# EAGLE design USB To Uart_3V3 (EAGLE 6.4)
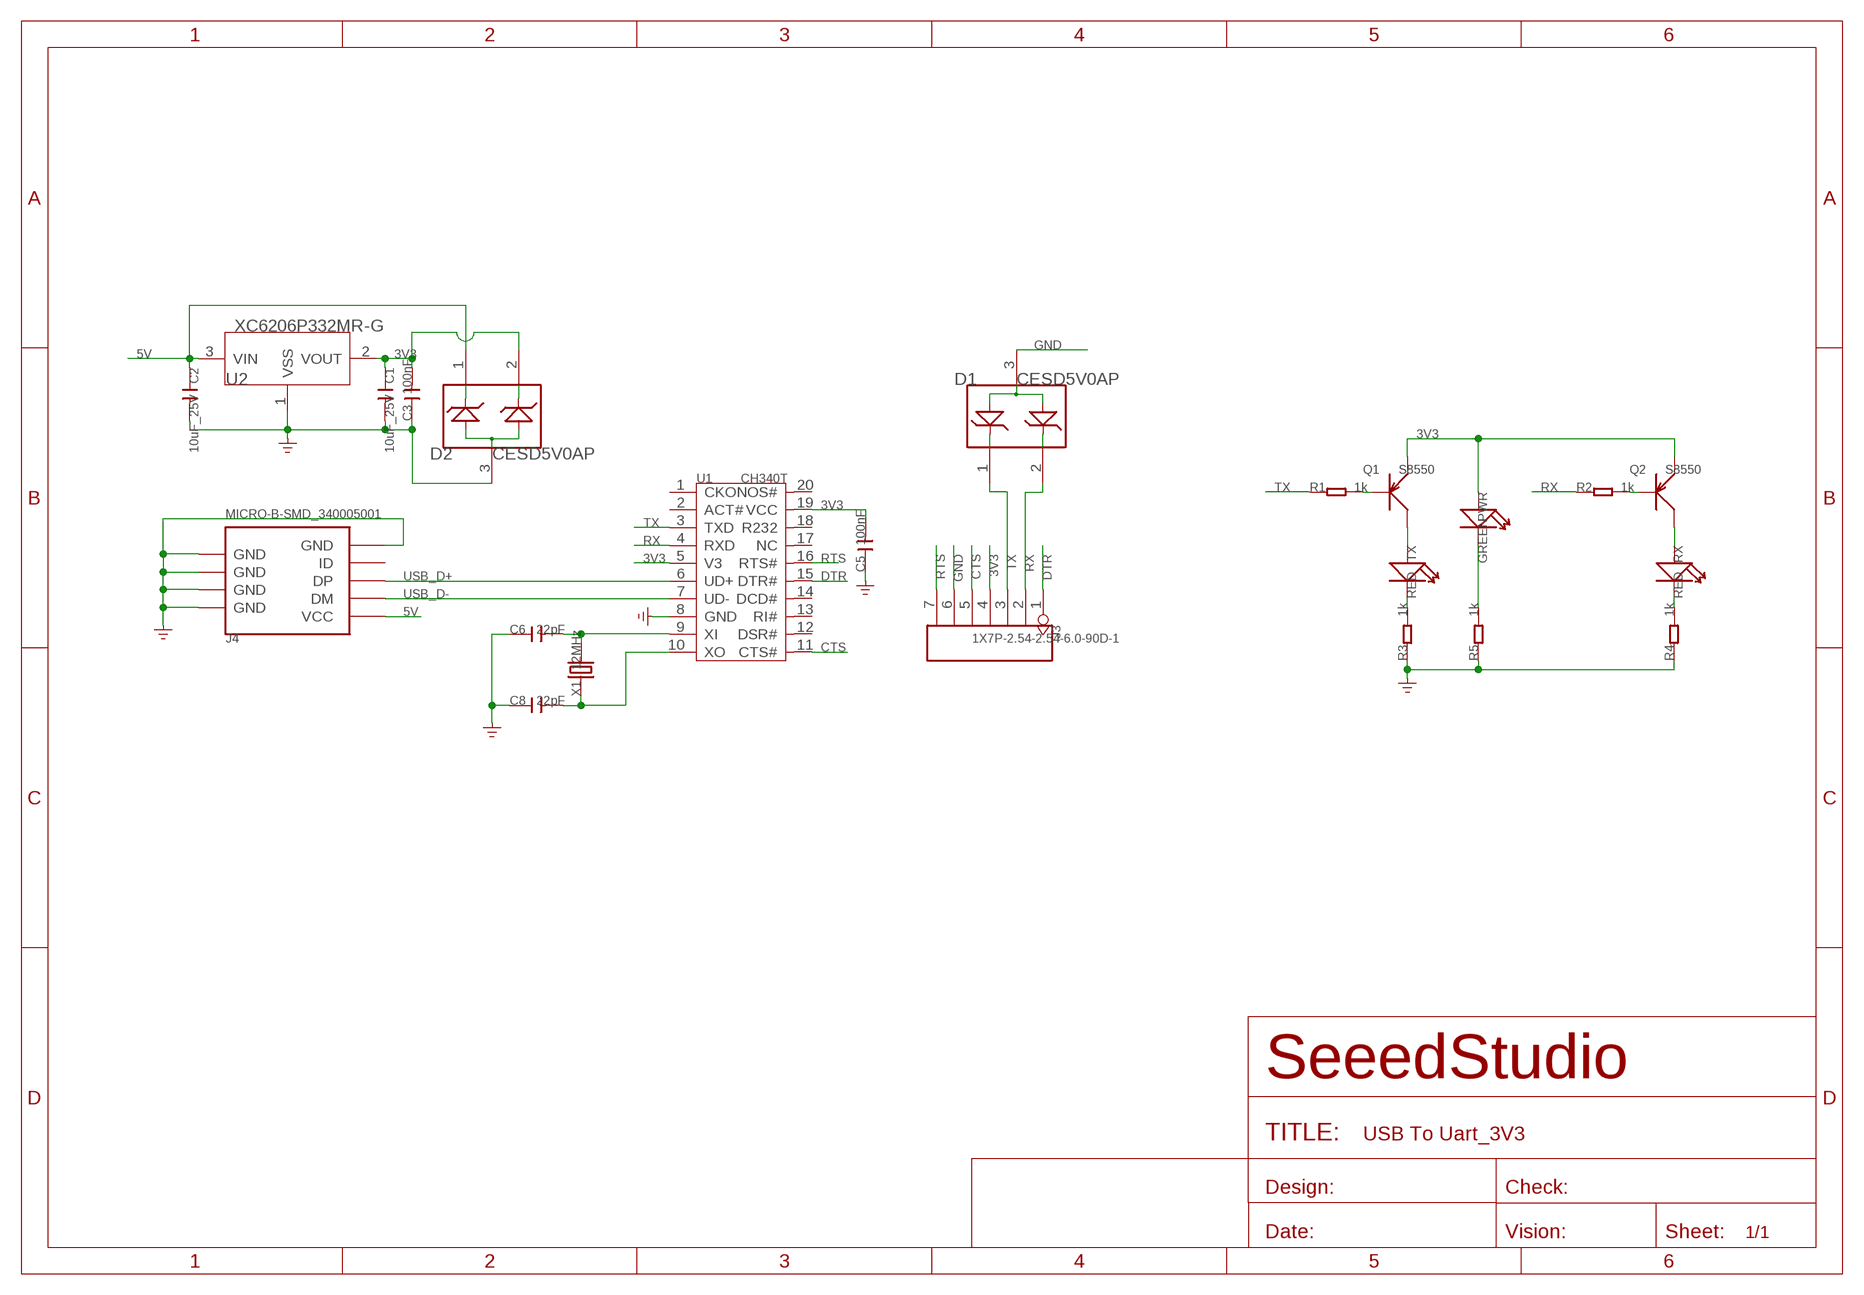
[diagram p0: schematic, sheet 1]

## Parts
C1  10uF_25V  C-0805  [C0805]
C2  10uF_25V  C-0805  [C0805]
C3  100nF  C-0402  [C0402]
C5  100nF  C-0402  [C0402]
C6  22pF  C-0402  [C0402]
C8  22pF  C-0402  [C0402]
D1  CESD5V0AP  D-ESD-3P  [SOT23]
D2  CESD5V0AP  D-ESD-3P  [SOT23]
J3  1X7P-2.54-2.54-6.0-90D-1  HEADER-7P  [7P-2.54-65/35MIL]
J4  MICRO-B-SMD_340005001  USB-MINIUSB-5P-MICRO  [MICRO-USB]
PWR  GREEN  LED'0603'  [LED-0603]
Q1  S8550  TRANSISTOR-PNP-SOT23  [SOT23]
Q2  S8550  TRANSISTOR-PNP-SOT23  [SOT23]
R1  1k  R-0402  [R0402]
R2  1k  R-0402  [R0402]
R3  1k  R-0402  [R0402]
R4  1k  R-0402  [R0402]
R5  1k  R-0402  [R0402]
RX  RED  LED'0603'  [LED-0603]
TX  RED  LED'0603'  [LED-0603]
U1  CH340T  [SSOP20]
U2  XC6206P332MR-G  XC6206MR  [SOT23]
X1  12MHz  CRYSTAL'HC49UP'  [HC49UP]

## Nets
3V3: C1.1 C3.2 C5.2 D2.2 J3.4 PWR.+ Q1.2(E) Q2.2(E) U1.5(V3) U1.19(VCC) U2.2(VOUT)
5V: C2.1 D2.1 J4.1(VCC) U2.3(VIN)
CTS: J3.5 U1.11(CTS#)
DTR: J3.1 U1.15(DTR#)
GND: C1.2 C2.2 C3.1 C5.1 C6.1 C8.1 D1.3 D2.3 J3.6 J4.5(GND) J4.S1(GND) J4.S2(GND) J4.S3(GND) J4.S4(GND) J4.S5(GND) J4.S6(GND) R3.1 R4.1 R5.1 U1.8(GND) U2.1(VSS)
N$1: Q1.3(C) TX.+
N$2: Q2.3(C) RX.+
N$4: C6.2 U1.9(XI) X1.2
N$5: C8.2 U1.10(XO) X1.1
N$6: R3.2 TX.-
N$7: Q1.1(B) R1.2
N$8: Q2.1(B) R2.2
N$10: R4.2 RX.-
N$12: PWR.- R5.2
RTS: J3.7 U1.16(RTS#)
RX: D1.2 J3.2 R2.1 U1.4(RXD)
TX: D1.1 J3.3 R1.1 U1.3(TXD)
USB_D+: J4.3(DP) U1.6(UD+)
USB_D-: J4.2(DM) U1.7(UD-)
Unconnected: J4.4(ID) U1.1(CKO) U1.2(ACT#) U1.12(DSR#) U1.13(RI#) U1.14(DCD#) U1.17(NC) U1.18(R232) U1.20(NOS#)

## Library data of the parts
C1-C3 C5 C6 C8 = Discrete:C*: Ceramic Capacitors
D1 D2 = Discrete:D-ESD-3P
J3 = Connector :HEADER-7P
J4 = Connector :USB-MINIUSB-5P
PWR RX TX = Discrete:LED*
Q1 Q2 = Discrete:TRANSISTOR-PNP*: PNP audion
R1-R5 = Discrete:R*
U1 = template:CH340T
U2 = IC:XC6206: LOW ESR Cap.Compatible Positive Voltage Regulators
X1 = Discrete:CRYSTAL*: CRYSTAL

## Net classes
0 default: width 0.152 mm, drill 0.305 mm, clearance 0.152 mm

## Board
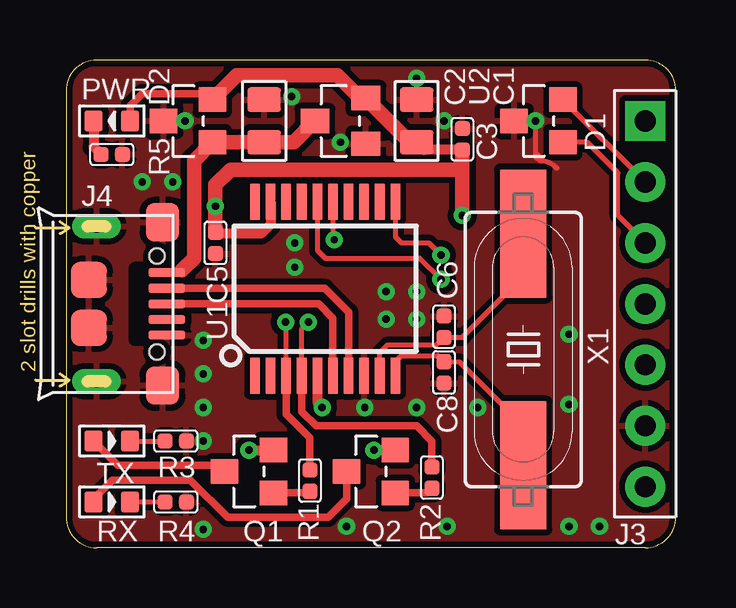
[diagram p1: board, top side]
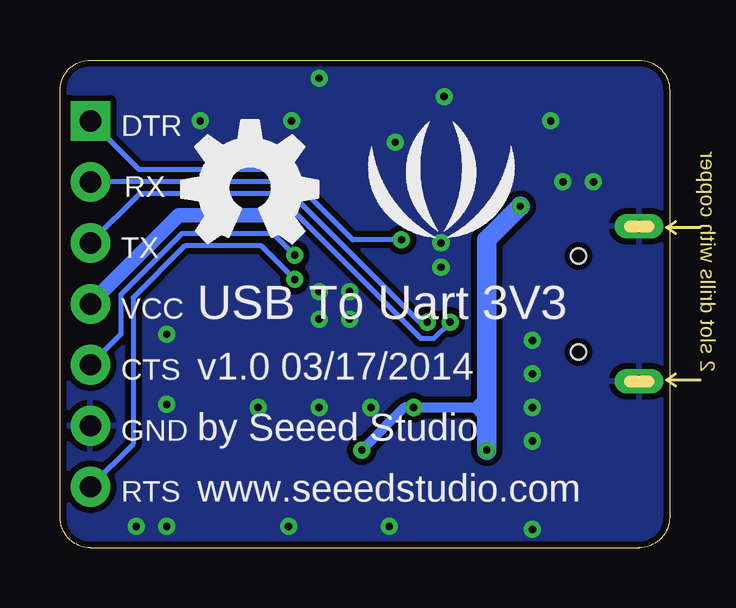
[diagram p2: board, bottom side, seen from below]

Size 25.4 x 20.32 mm. Coordinates in mm from the lower left corner, seen from the top.
Outline: 0,19.05 0,1.27 arc90 1.27,0 24.13,0 arc90 25.4,1.27 25.4,19.05 arc90 24.13,20.32 1.27,20.32 arc90 0,19.05
Copper layers (1*16): Top 0.035mm / dielectric 1.5mm / Bottom 0.035mm
Design rules "default *": minimum track width 8mil, minimum drill 12mil, track to track 8mil, track to pad 8mil, pad to pad 8mil, via to via 8mil, smd to smd 0mil, copper to edge 8mil, drill to drill 8mil, minimum pad ring 10mil, minimum via ring 8mil, stop-mask expansion 4mil, vias tented up to drill 25mil, thermal gap 10mil

### Footprints (pad centres in the part's own frame; a part is rotated, then mirrored left to right if it is on the bottom)
C0805 = smd 1.016 x 1.397: 1 -0.889,0; 2 0.889,0
C0402 = smd 0.635 x 0.635: 1 -0.445,0; 2 0.445,0
SOT23 = smd 1.016 x 1.143: 1 -0.889,-1.016; 2 0.889,-1.016; 3 0,1.016
7P-2.54-65/35MIL = drill 0.889 pad 1.651 square: 1 0,7.62 | drill 0.889 pad 1.651: 2 0,5.08; 3 0,2.54; 4 0,0; 5 0,-2.54; 6 0,-5.08; 7 0,-7.62
MICRO-USB = smd 0.381 x 1.524: 1 -1.3,-0.25; 2 -0.65,-0.25; 3 0,-0.25; 4 0.65,-0.25; 5 1.3,-0.25 | smd 1.6 x 1.397: S1 -3.4,-0.427; S6 3.4,-0.427 | drill 0.508 pad 1.016 long: S2 -3.226,-3.175; S5 3.226,-3.175 | smd 1.5 x 1.5: S3 -1,-3.5; S4 1,-3.5 | hole 0.635: -2,-0.65; 2,-0.65
LED-0603 = smd 0.762 x 0.889: + -0.762,0; - 0.762,0
R0402 = smd 0.635 x 0.635: 1 -0.445,0; 2 0.445,0
SSOP20 = smd 0.4 x 1.5: 1 -2.925,-3.625; 2 -2.275,-3.625; 3 -1.625,-3.625; 4 -0.975,-3.625; 5 -0.325,-3.625; 6 0.325,-3.625; 7 0.975,-3.625; 8 1.625,-3.625; 9 2.275,-3.625; 10 2.925,-3.625; 11 2.925,3.625; 12 2.275,3.625; 13 1.625,3.625; 14 0.975,3.625; 15 0.325,3.625; 16 -0.325,3.625; 17 -0.975,3.625; 18 -1.625,3.625; 19 -2.275,3.625; 20 -2.925,3.625
SOT23' = smd 1.016 x 1.2: 1 -0.95,-1.06; 2 0.95,-1.06; 3 0,1.06
HC49UP = smd 5.334 x 1.93: 1 -4.826,0; 2 4.826,0

### Placement (x,y rotation side)
C1  14.61,17.78 90 top
C2  8.26,17.78 90 top
C3  16.51,17.02 270 top
C5  6.22,12.7 90 top
C6  15.75,9.21 270 top
C8  15.75,7.3 90 top
D1  19.68,17.78 90 top
D2  5.08,17.78 90 top
J3  24.13,10.16 0 top
J4  4.45,10.16 270 top
PWR  1.91,17.78 180 top
Q1  7.62,3.17 90 top
Q2  12.7,3.17 90 top
R1  10.16,2.79 270 top
R2  15.24,2.92 270 top
R3  4.57,4.45 180 top
R4  4.57,1.91 180 top
R5  1.91,16.38 180 top
RX  1.91,1.91 0 top
TX  1.91,4.45 0 top
U1  10.79,10.79 0 top
U2  XC6206P332MR-G  [SOT23']  11.43,17.78 90 top
U$8  [LOGO_SILK]  9.53,14.61 0 bottom
U$9  [OSHW_FILLX200_NOTEXT]  20.32,12.7 0 bottom
X1  19.05,8.26 90 top

### Tracks (layer width: path | path; a pad name or v marks a point on that pad's centre or on a via)
3V3  (via drill 0.3, 0.3 pad 0.64)
  Top 0.305: D2.2 5.84,18.92 3.17,18.92 2.67,18.41 PWR.+
  Top 0.406: Q2.2 v12.83,4.06 | v7.62,4.06 Q1.2 | U1.5 10.47,6.04 v10.67,5.84 | U1.19 8.52,13.47 8.13,13.08 6.29,13.08 C5.2 | C3.2 14.92,16.57 C1.1
  Top 0.61: C1.1 14.33,16.89 U2.2 12.26,18.73 11.3,19.68 7.11,19.68 D2.2 | C3.2 16.51,16 | 16.51,16 16.26,15.75 6.86,15.75 6.22,15.11 v6.22,14.22 C5.2 | 16.51,16 v16.51,13.84
  Bottom 0.406: 8.13,5.84 v10.67,5.84 11.05,5.84 v12.83,4.06 | 8.13,5.84 7.62,6.35 | 8.13,5.84 7.75,5.46
  Bottom 0.61: v16.51,13.84 20.45,13.84 J3.4
  Bottom 0.813: v7.62,4.06 7.62,6.35 7.62,12.83 v6.22,14.22
5V
  Top 0.203: J4.1 4.73,11.46 4.83,11.56
  Top 0.61: 4.83,11.56 5.33,12.06 5.33,16.13 D2.1 C2.1 9.48,16.89 U2.3
CTS  (via drill 0.3)
  Top 0.203: U1.11 13.72,12.95 13.97,12.7 15.11,12.7 v15.62,12.19
  Bottom 0.203: v15.62,12.19 16.51,13.08 20.32,13.08 22.86,10.54 22.86,8.89 J3.5
DTR  (via drill 0.3)
  Top 0.203: U1.15 11.12,12.88 v11.18,12.83
  Bottom 0.203: v11.18,12.83 13.21,12.83 16.13,15.75 21.84,15.75 22.1,15.75 J3.1
GND  (via drill 0.3 pad 0.64)
  Top 0.203: v19.56,17.78 19.56,16.45 | 19.56,16.45 19.88,16.13 | 19.56,16.45 19.56,16.38 | 19.56,16.38 19.81,16.13 | 20.35,15.9 20.38,15.88 | 19.56,16.38 19.56,16.32 19.75,16.13 arc-45 20.4,15.86 20.45,15.81
  other vias: 5.71,4.45 5.71,0.76 15.88,0.89 11.68,0.89 22.23,0.89 9.53,12.7 5.71,7.24 5.71,5.84 4.45,15.24 9.4,18.8 14.61,19.56 15.75,17.78 3.17,15.24 20.95,0.89 11.43,16.89 13.34,10.67 14.61,10.67 9.53,11.68 13.34,9.53 14.61,9.53 4.95,17.78 12.45,5.84 14.61,5.84 5.71,8.64 17.14,5.84 20.95,5.97 20.95,8.89
  pour Top (isolate 0.254): 0,20.32 25.4,20.32 25.4,0 0,0
  pour Bottom (isolate 0.254): 0,20.32 25.4,20.32 25.4,0 0,0
N$1
  Top 0.305: TX.+ 2.16,3.43 6.35,3.43 Q1.3
N$2
  Top 0.305: RX.+ 1.14,2.03 1.93,2.82 5.18,2.82 6.73,1.27 10.92,1.27 11.68,2.03 Q2.3
N$4
  Top 0.203: U1.9 13.07,8.12 13.4,8.45 15.43,8.45 C6.2 16.51,8.76 18.92,11.18 18.92,12.95 X1.2
N$5
  Top 0.203: U1.10 13.72,7.75 13.97,8 15.49,8 C8.2 16.38,7.75 19.05,5.08 X1.1
N$6
  Top 0.203: TX.- R3.2
N$7
  Top 0.305: Q1.1 10.1,2.29 R1.2
N$8
  Top 0.305: Q2.1 15.05,2.29 R2.2
N$10
  Top 0.203: RX.- R4.2
N$12
  Top 0.406: PWR.- 1.14,16.7 R5.2
RTS  (via drill 0.3)
  Top 0.203: U1.16 10.47,12.39 10.79,12.06 14.73,12.06 v15.62,11.18
  Bottom 0.203: v15.62,11.18 17.02,12.57 20.19,12.57 22.35,10.41 22.35,4.32 J3.7
RX  (via drill 0.3)
  Top 0.203: 9.82,7.02 9.82,9.12 v10.1,9.4 | J3.2 D1.2
  Top 0.305: U1.4 9.82,7.02 9.82,5.67 10.41,5.08 14.61,5.08 15.24,4.45 R2.1
  Bottom 0.203: v10.1,9.4 10.41,9.4 16.26,15.24 J3.2
TX  (via drill 0.3)
  Top 0.203: D1.1 21.72,16.89 22.99,15.62 22.99,13.84 J3.3 | U1.3 9.17,9.37 v9.14,9.4
  Top 0.305: U1.3 9.17,5.56 10.16,4.57 R1.1
  Bottom 0.203: v9.14,9.4 9.82,8.72 10.38,8.72 16.39,14.74 22.09,14.74 J3.3
USB_D+
  Top 0.305: J4.3 10.53,10.16 11.12,9.57 U1.6
USB_D-
  Top 0.305: U1.7 11.77,9.81 10.77,10.81 J4.2

### Text on the board
bPlace: DTR | RX | TX | USB To Uart 3V3 | VCC | v1.0 03/17/2014 | CTS | by Seeed Studio | GND | www.seeedstudio.com | RTS